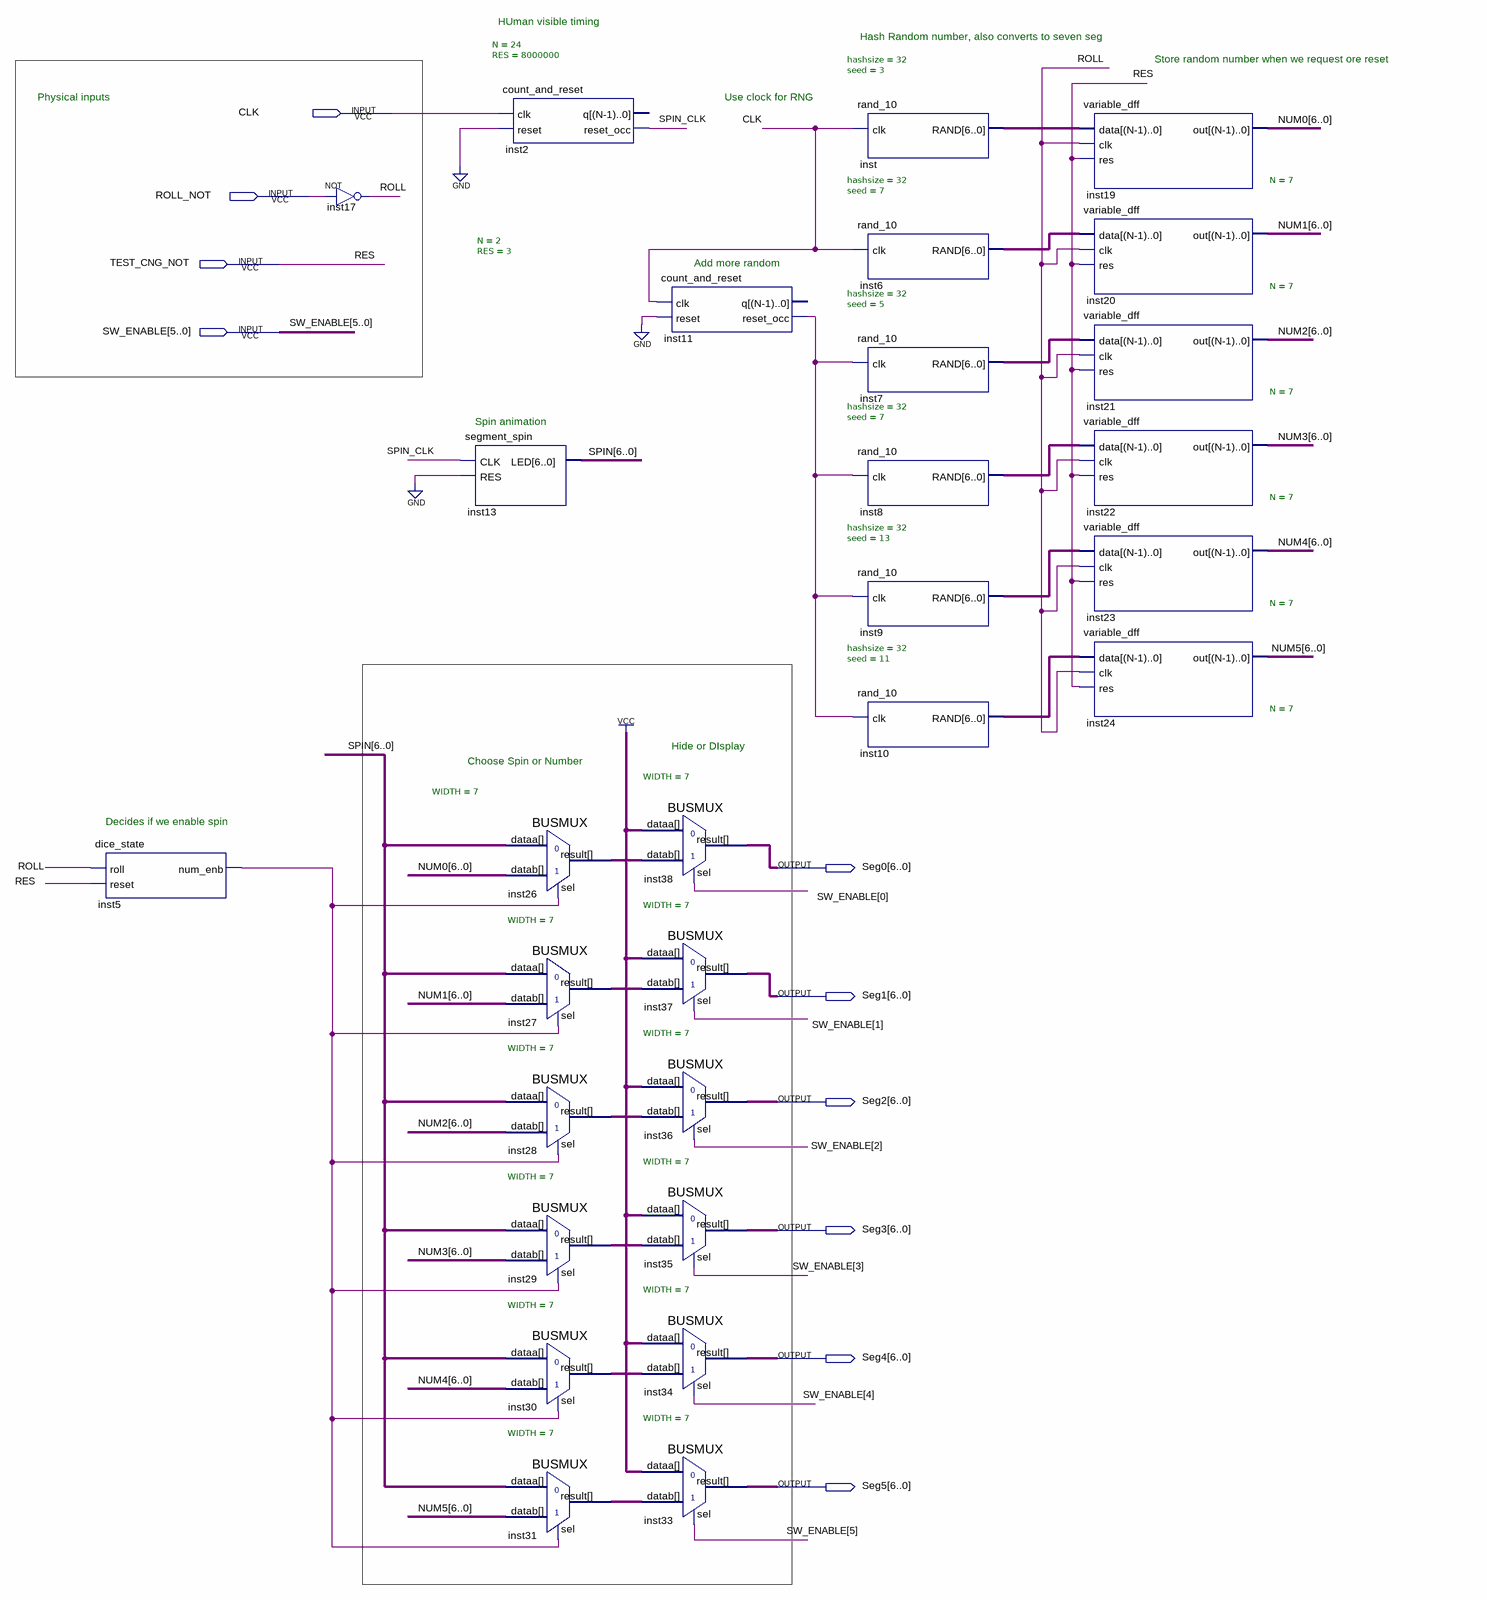
[diagram p0: schematic sheet]
// Quartus schematic dice.bdf as structural Verilog: 29 symbols, 10 pins
module dice (
  input  CLK,
  input  ROLL_NOT,
  input  TEST_CNG_NOT,
  input  [5:0] SW_ENABLE,
  output [6:0] Seg0,
  output [6:0] Seg1,
  output [6:0] Seg2,
  output [6:0] Seg3,
  output [6:0] Seg4,
  output [6:0] Seg5
);

  wire inst5_num_enb, inst11_reset_occ, ROLL, SPIN_CLK;
  wire [6:0] inst6_rand, inst7_rand, inst8_rand, inst9_rand, inst10_rand, inst26_result, inst27_result,
       inst28_result, inst29_result, inst30_result, inst31_result, inst_rand, NUM0, NUM1, NUM2, NUM3, NUM4,
       NUM5, SPIN;

  dice_state inst5 (.roll(ROLL), .reset(TEST_CNG_NOT), .num_enb(inst5_num_enb));
  not inst17 (ROLL, ROLL_NOT);
  count_and_reset #(.N(24), .RES(8000000)) inst2 (.clk(CLK), .reset(1'b0), .reset_occ(SPIN_CLK));  // open: q
  segment_spin inst13 (.CLK(SPIN_CLK), .RES(1'b0), .LED(SPIN));
  BUSMUX #(.WIDTH(7)) inst26 (.datab(NUM0), .sel(inst5_num_enb), .dataa(SPIN), .result(inst26_result));
  BUSMUX #(.WIDTH(7)) inst27 (.datab(NUM1), .sel(inst5_num_enb), .dataa(SPIN), .result(inst27_result));
  BUSMUX #(.WIDTH(7)) inst28 (.datab(NUM2), .sel(inst5_num_enb), .dataa(SPIN), .result(inst28_result));
  BUSMUX #(.WIDTH(7)) inst29 (.datab(NUM3), .sel(inst5_num_enb), .dataa(SPIN), .result(inst29_result));
  BUSMUX #(.WIDTH(7)) inst30 (.datab(NUM4), .sel(inst5_num_enb), .dataa(SPIN), .result(inst30_result));
  BUSMUX #(.WIDTH(7)) inst31 (.datab(NUM5), .sel(inst5_num_enb), .dataa(SPIN), .result(inst31_result));
  count_and_reset #(.N(2), .RES(3)) inst11 (.clk(CLK), .reset(1'b0), .reset_occ(inst11_reset_occ));  // open: q
  BUSMUX #(.WIDTH(7)) inst38 (.datab(inst26_result), .sel(SW_ENABLE[0]), .dataa({7{1'b1}}), .result(Seg0));
  BUSMUX #(.WIDTH(7)) inst37 (.datab(inst27_result), .sel(SW_ENABLE[1]), .dataa({7{1'b1}}), .result(Seg1));
  BUSMUX #(.WIDTH(7)) inst36 (.datab(inst28_result), .sel(SW_ENABLE[2]), .dataa({7{1'b1}}), .result(Seg2));
  BUSMUX #(.WIDTH(7)) inst35 (.datab(inst29_result), .sel(SW_ENABLE[3]), .dataa({7{1'b1}}), .result(Seg3));
  BUSMUX #(.WIDTH(7)) inst34 (.datab(inst30_result), .sel(SW_ENABLE[4]), .dataa({7{1'b1}}), .result(Seg4));
  BUSMUX #(.WIDTH(7)) inst33 (.datab(inst31_result), .sel(SW_ENABLE[5]), .dataa({7{1'b1}}), .result(Seg5));
  rand_10 #(.hashsize(32), .seed(3)) inst (.clk(CLK), .RAND(inst_rand));
  rand_10 #(.hashsize(32), .seed(7)) inst6 (.clk(CLK), .RAND(inst6_rand));
  rand_10 #(.hashsize(32), .seed(5)) inst7 (.clk(inst11_reset_occ), .RAND(inst7_rand));
  rand_10 #(.hashsize(32), .seed(7)) inst8 (.clk(inst11_reset_occ), .RAND(inst8_rand));
  rand_10 #(.hashsize(32), .seed(13)) inst9 (.clk(inst11_reset_occ), .RAND(inst9_rand));
  rand_10 #(.hashsize(32), .seed(11)) inst10 (.clk(inst11_reset_occ), .RAND(inst10_rand));
  variable_dff #(.N(7)) inst19 (.data(inst_rand), .clk(ROLL), .res(TEST_CNG_NOT), .out(NUM0));
  variable_dff #(.N(7)) inst20 (.data(inst6_rand), .clk(ROLL), .res(TEST_CNG_NOT), .out(NUM1));
  variable_dff #(.N(7)) inst21 (.data(inst7_rand), .clk(ROLL), .res(TEST_CNG_NOT), .out(NUM2));
  variable_dff #(.N(7)) inst22 (.data(inst8_rand), .clk(ROLL), .res(TEST_CNG_NOT), .out(NUM3));
  variable_dff #(.N(7)) inst23 (.data(inst9_rand), .clk(ROLL), .res(TEST_CNG_NOT), .out(NUM4));
  variable_dff #(.N(7)) inst24 (.data(inst10_rand), .clk(ROLL), .res(TEST_CNG_NOT), .out(NUM5));

  // Other names for the same wires on the sheet: RES = TEST_CNG_NOT

  // Notes on the sheet:
  //   HUman visible timing
  //   Hash Random number, also converts to seven seg
  //   Store random number when we request ore reset
  //   Physical inputs
  //   Use clock for RNG
  //   Add more random
  //   Spin animation
  //   Hide or DIsplay
  //   Choose Spin or Number
  //   Decides if we enable spin
endmodule
